# Altium schematic sheet Coverpage.SchDoc
size A3; SheetNumber: 1; SheetTotal: 5
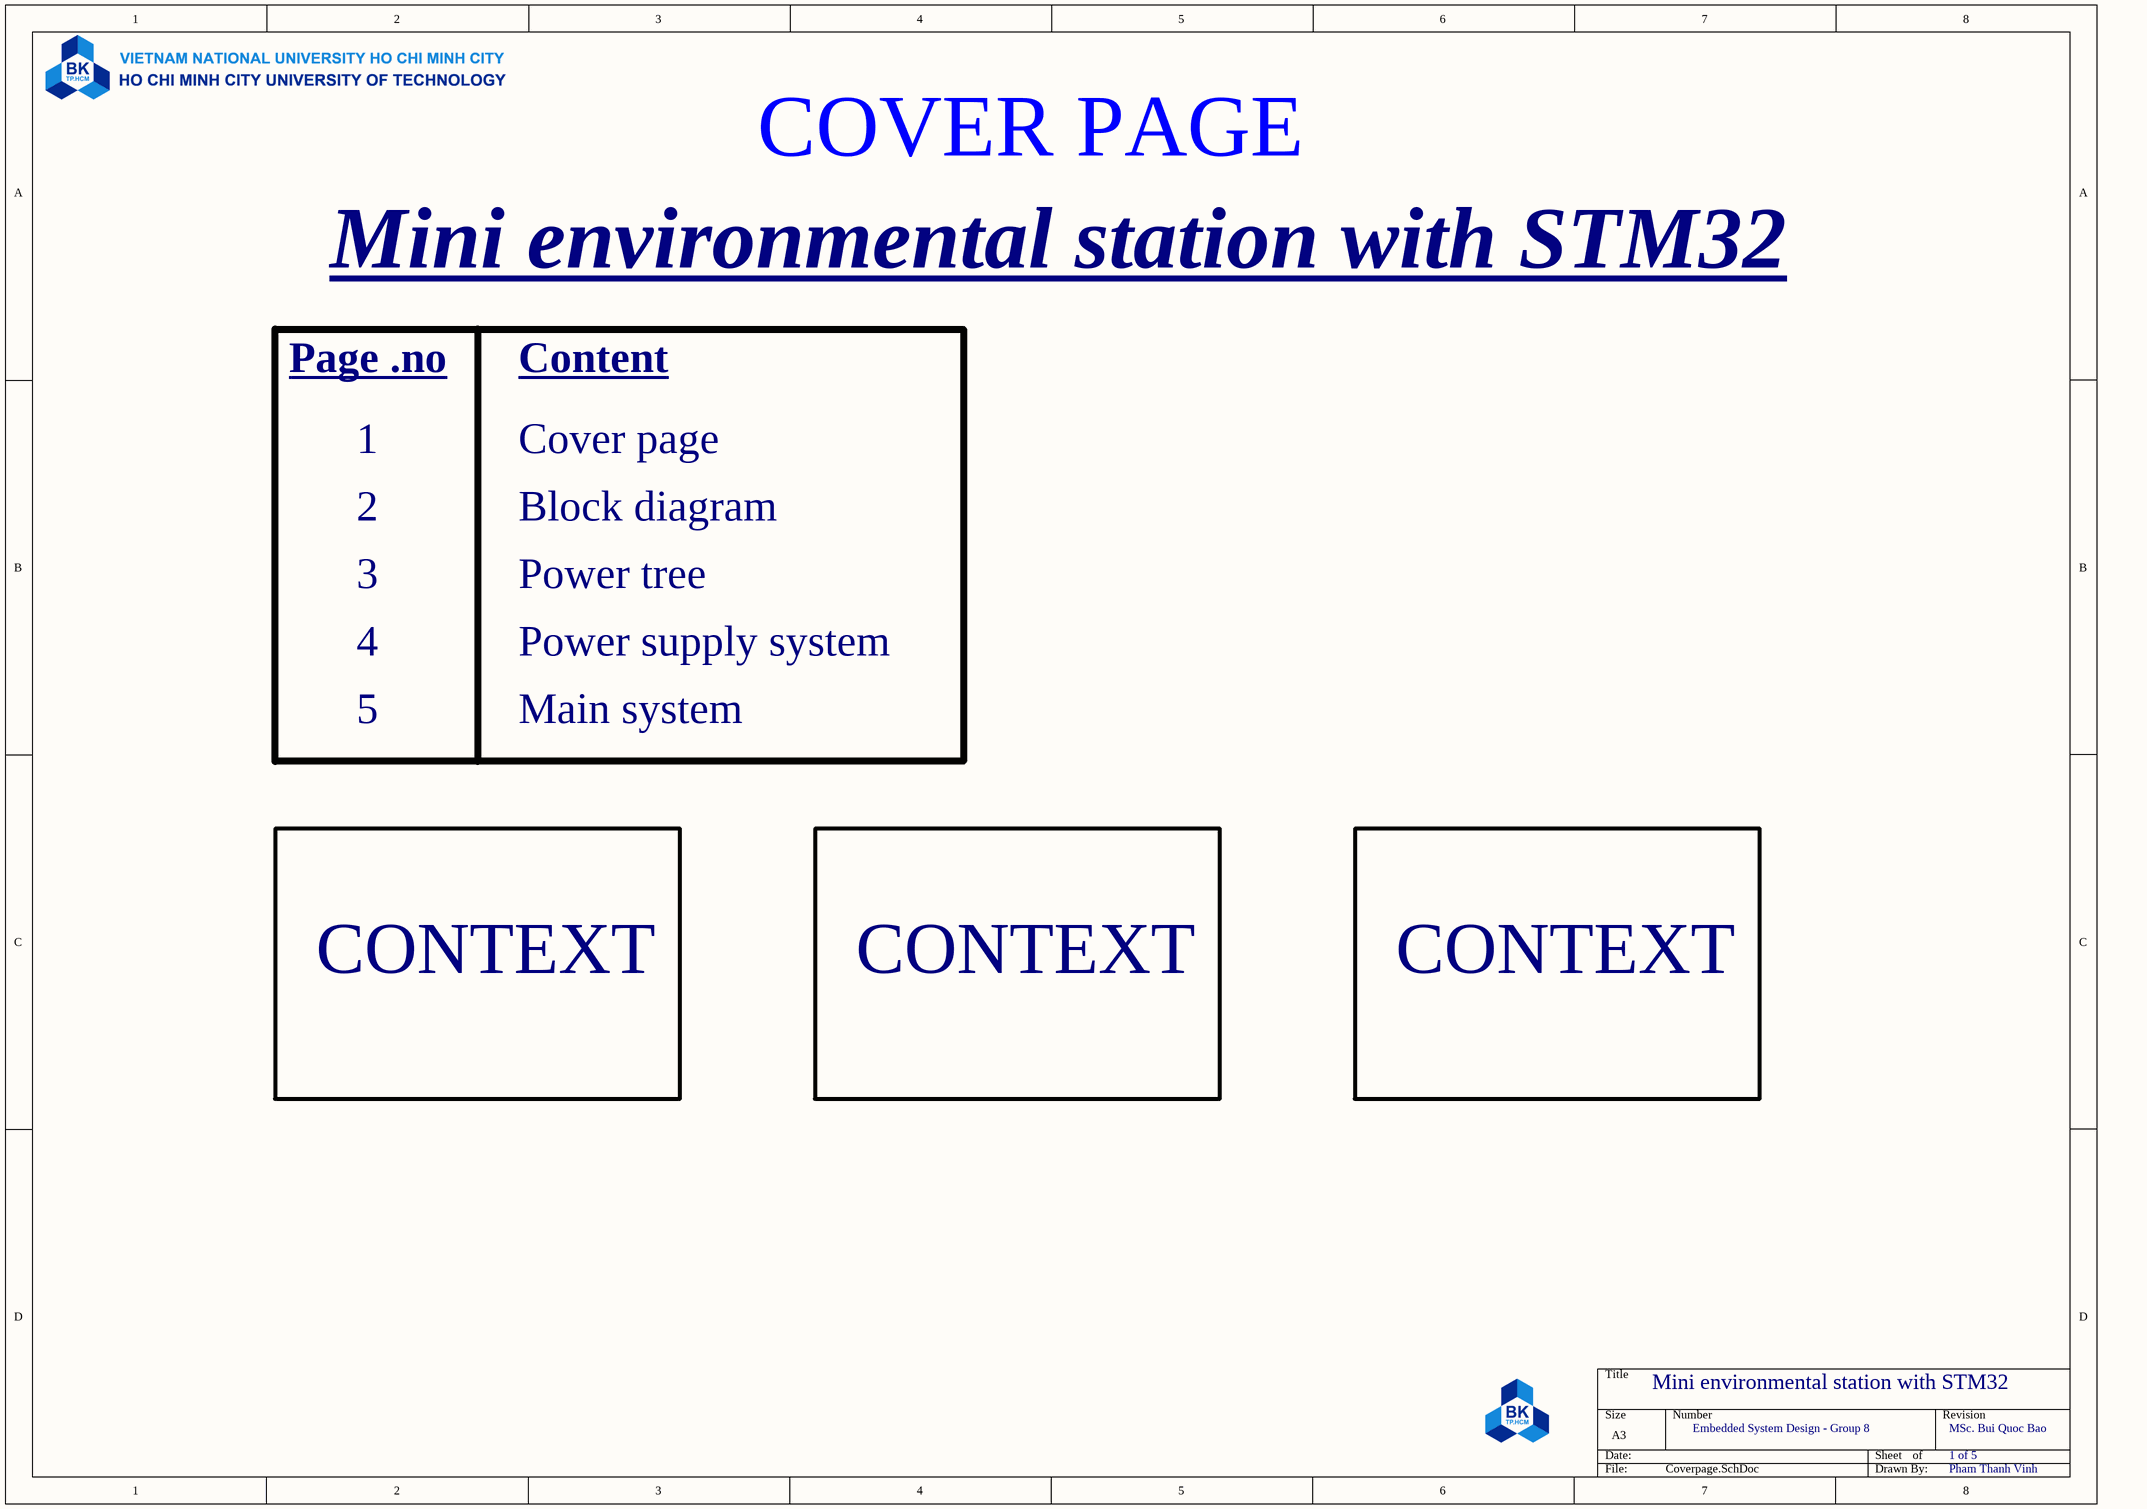
[diagram p0: Coverpage.SchDoc]

## Notes on the sheet
- COVER PAGE
- Mini environmental station with STM32
- Page .no
- Content
- 1
- Cover page
- 2
- Block diagram
- 3
- Power tree
- 4
- Power supply system
- 5
- Main system
- CONTEXT
- Embedded System Design - Group 8
- MSc. Bui Quoc Bao
- 1 of 5
- Pham Thanh Vinh